# Altium schematic sheet 37-ETHERNET LEDs.SchDoc
size 513 x 386 mm
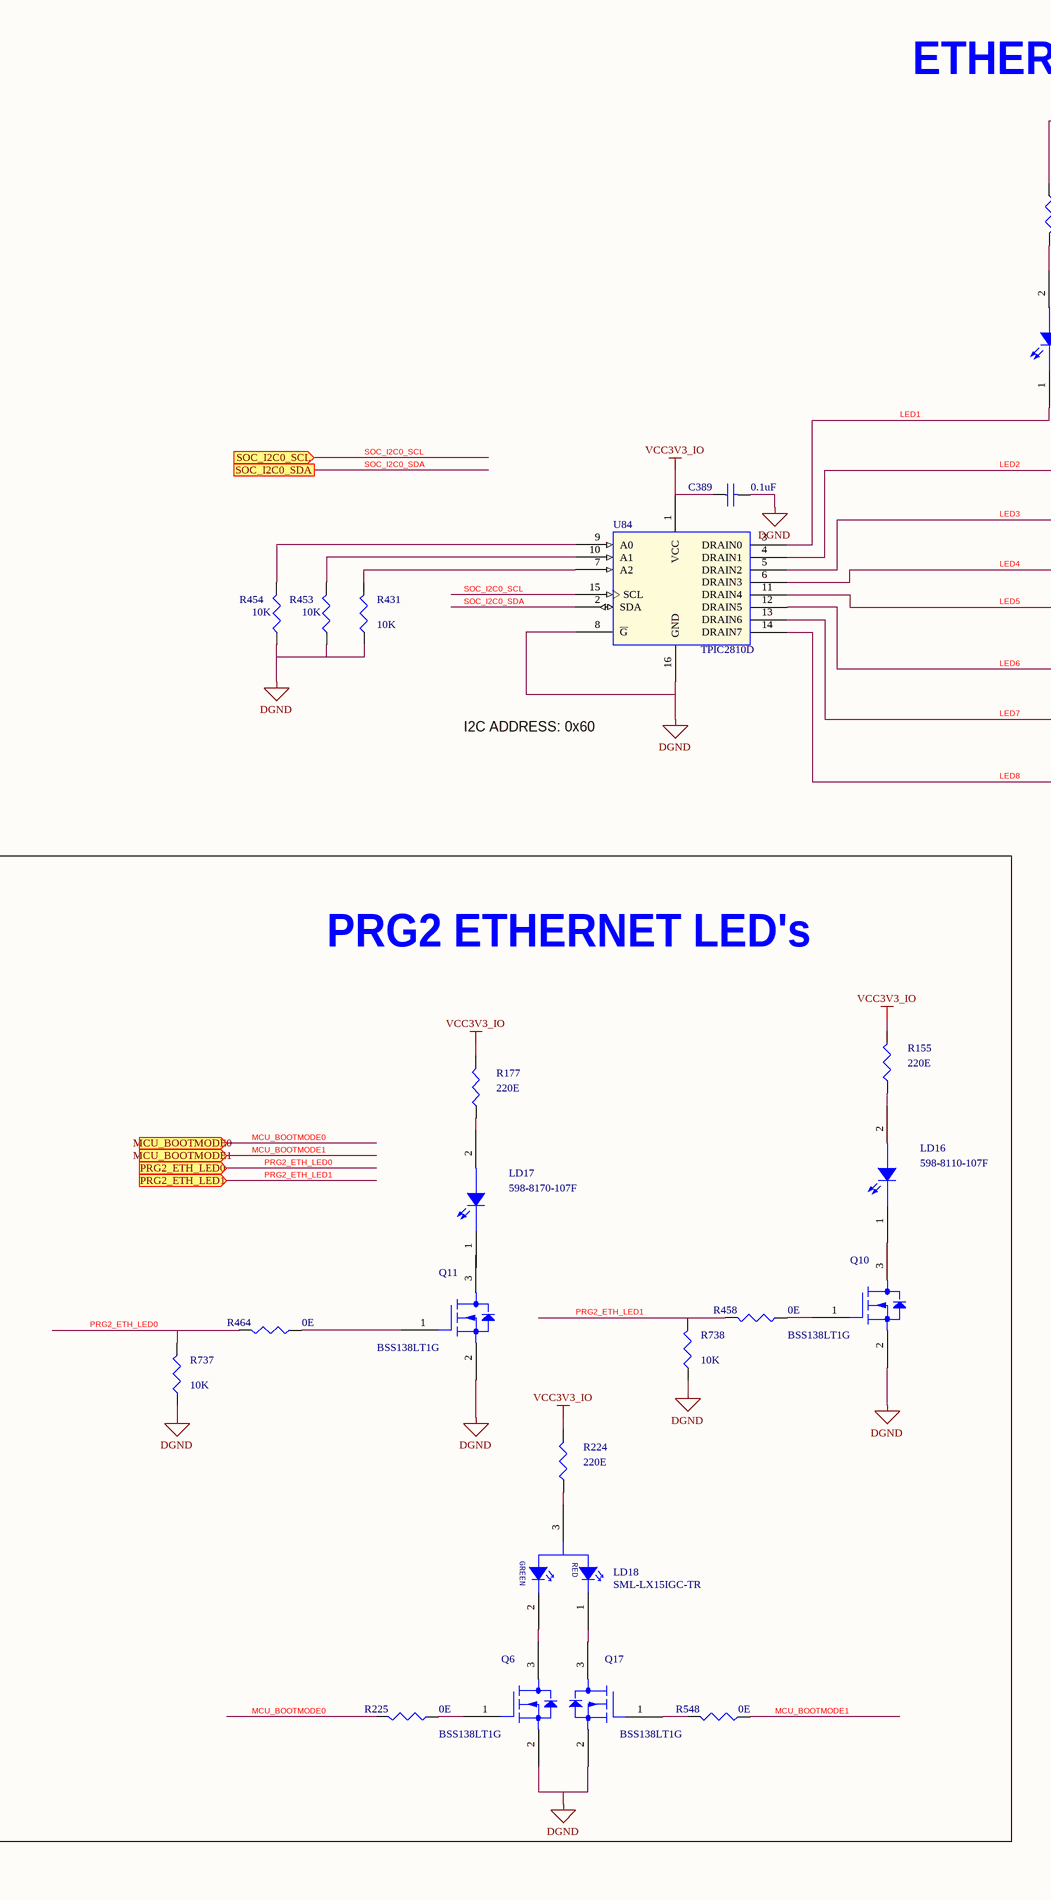
[diagram p0: 37-ETHERNET LEDs.SchDoc, left]
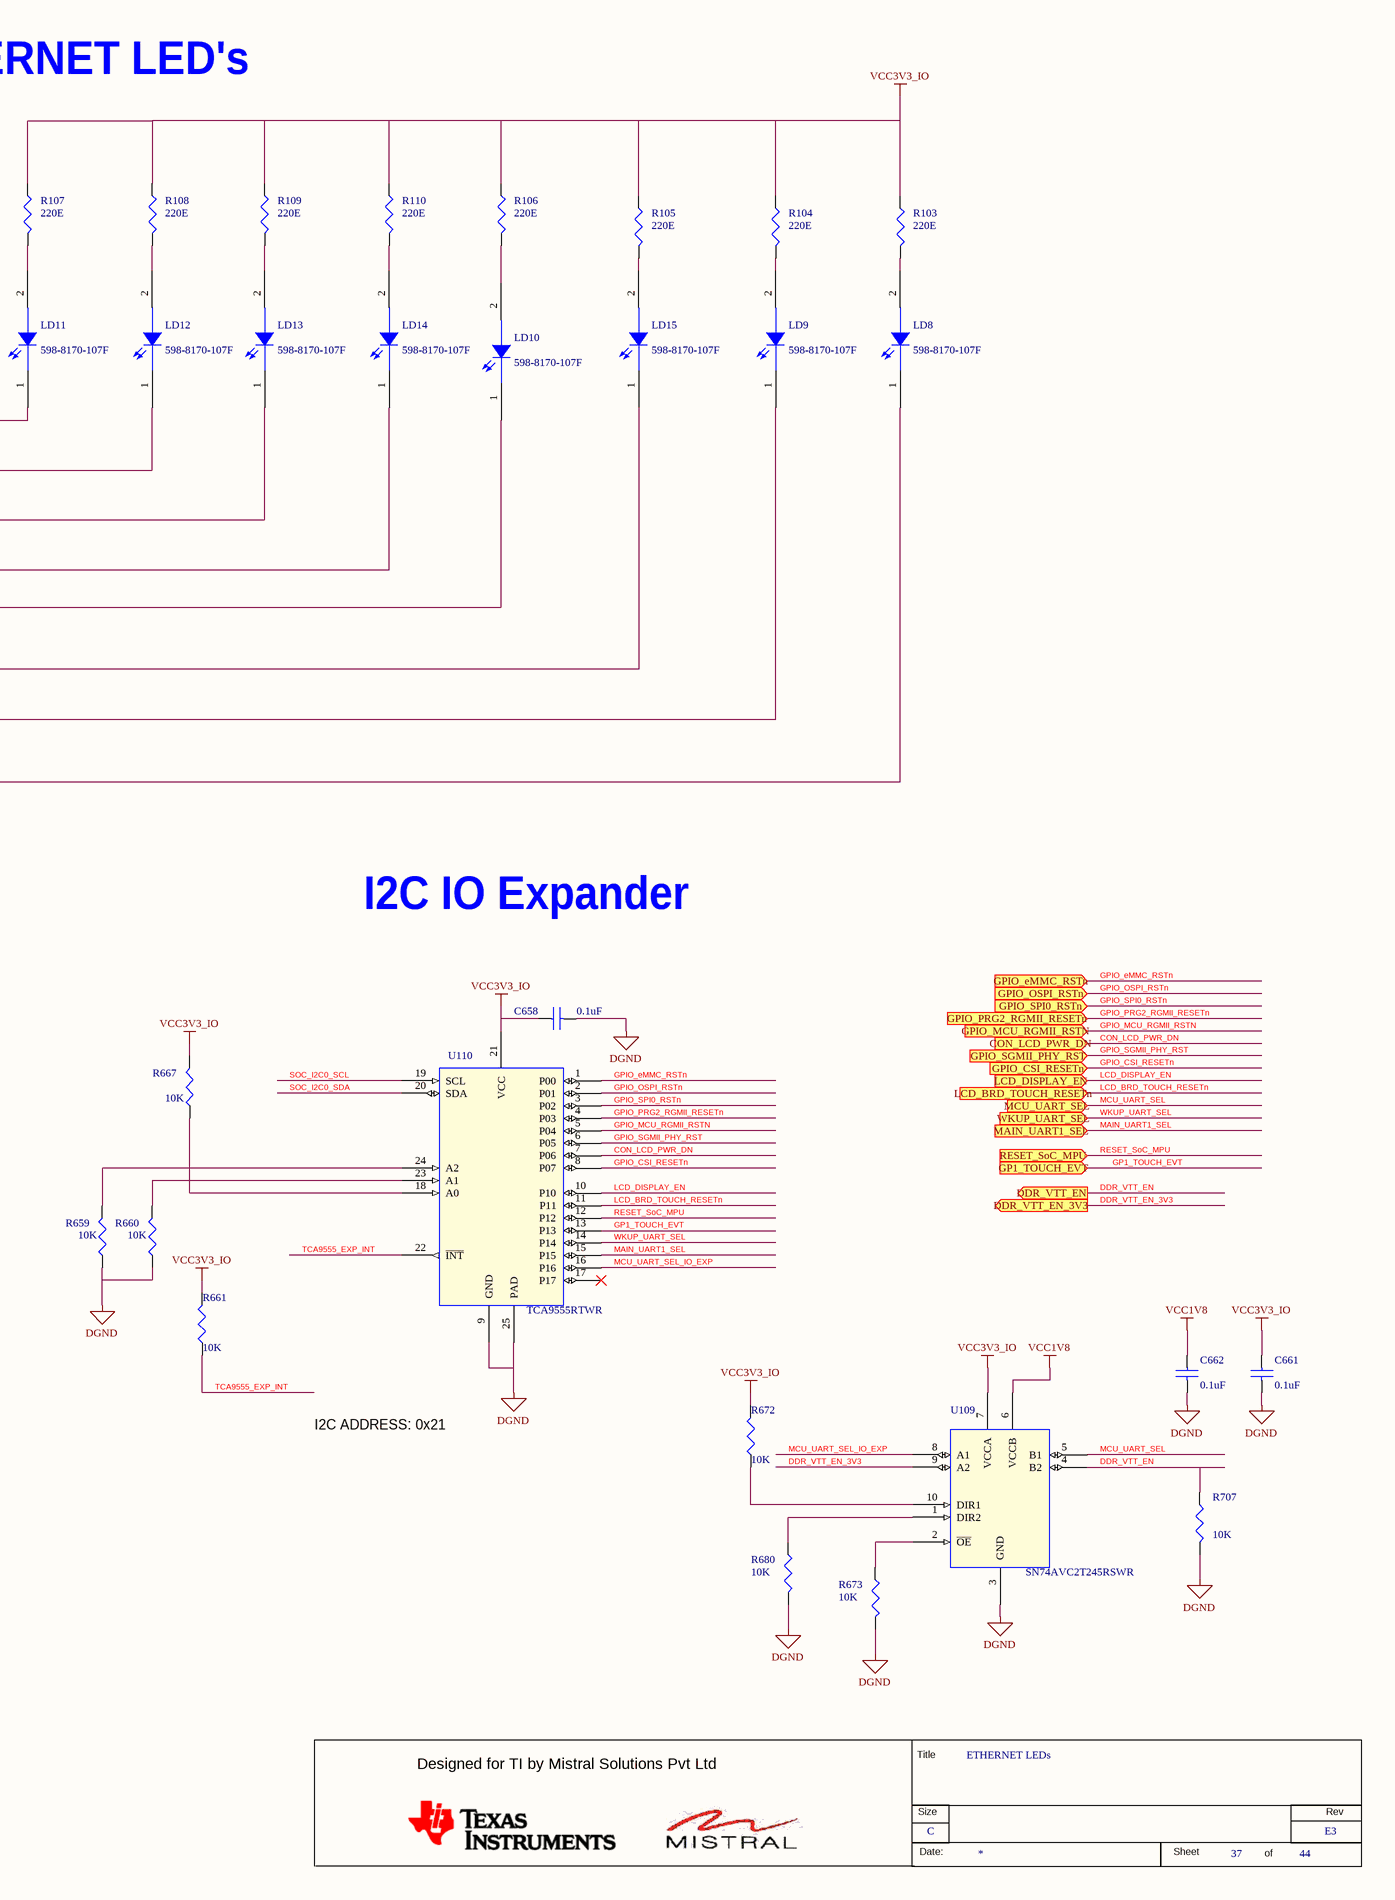
[diagram p1: 37-ETHERNET LEDs.SchDoc, right]

## Parts
*  RevCode: E3  Title: ETHERNET LEDs  Page Size: C  Page Number: 37  Page Count: 44  (hidden comment: MISTRAL_TITLEBLK_CSIZE)  (graphical)
C389  0.1uF  [CAP0201_0-5]
C658  0.1uF  [CAP0201_0-5]
C661  0.1uF  [CAP0201_0-5]
C662  0.1uF  [CAP0201_0-5]
LD8  598-8170-107F  [LED_0805_0-7]
LD9  598-8170-107F  [LED_0805_0-7]
LD10  598-8170-107F  [LED_0805_0-7]
LD11  598-8170-107F  [LED_0805_0-7]
LD12  598-8170-107F  [LED_0805_0-7]
LD13  598-8170-107F  [LED_0805_0-7]
LD14  598-8170-107F  [LED_0805_0-7]
LD15  598-8170-107F  [LED_0805_0-7]
LD16  598-8110-107F  [LED_0805]
LD17  598-8170-107F  [LED_0805_0-7]
LD18  SML-LX15IGC-TR  [LED3_SML-LX15IGC_120X120_SMD_1]
Q6  BSS138LT1G  [SOT23-123]
Q10  BSS138LT1G  [SOT23-123]
Q11  BSS138LT1G  [SOT23-123]
Q17  BSS138LT1G  [SOT23-123]
R103  220E  [RES0402_0-5]
R104  220E  [RES0402_0-5]
R105  220E  [RES0402_0-5]
R106  220E  [RES0402_0-5]
R107  220E  [RES0402_0-5]
R108  220E  [RES0402_0-5]
R109  220E  [RES0402_0-5]
R110  220E  [RES0402_0-5]
R155  220E  [RES0402_0-5]
R177  220E  [RES0402_0-5]
R224  220E  [RES0402_0-5]
R225  0E  [RES0402_0-5]
R431  10K  [RES0402_0-5]
R453  10K  [RES0402_0-5]
R454  10K  [RES0402_0-5]
R458  0E  [RES0402_0-5]
R464  0E  [RES0402_0-5]
R548  0E  [RES0402_0-5]
R659  10K  [RES0402_0-5]
R660  10K  [RES0402_0-5]
R661  10K  [RES0402_0-5]
R667  10K  [RES0402_0-5]
R672  10K  [RES0402_0-5]
R673  10K  [RES0402_0-5]
R680  10K  [RES0402_0-5]
R707  10K  [RES0402_0-5]
R737  10K  [RES0402_0-5]
R738  10K  [RES0402_0-5]
U84  TPIC2810D  [SOIC16_1-8]
U109  SN74AVC2T245RSWR  [QFN10_15-74_75X60]
U110  TCA9555RTWR  [QFN24_19-68_165X165]

## Blocks framed on the sheet
PRG2 ETHERNET LED's: LD16-LD18 Q6 Q10 Q11 Q17 R155 R177 R224 R225 R458 R464 R548 R737 R738

## Ports
CON_LCD_PWR_DN (in), DDR_VTT_EN (out), DDR_VTT_EN_3V3 (out), GP1_TOUCH_EVT (in), GPIO_CSI_RESETn (in), GPIO_eMMC_RSTn (in), GPIO_MCU_RGMII_RSTN (in), GPIO_OSPI_RSTn (in), GPIO_PRG2_RGMII_RESETn (in), GPIO_SGMII_PHY_RST (in), GPIO_SPI0_RSTn (in), LCD_BRD_TOUCH_RESETn (in), LCD_DISPLAY_EN (in), MAIN_UART1_SEL (in), MCU_BOOTMODE0 (in), MCU_BOOTMODE1 (in), MCU_UART_SEL (in), PRG2_ETH_LED0 (in), PRG2_ETH_LED1 (in), RESET_SoC_MPU (in), SOC_I2C0_SCL (in), SOC_I2C0_SDA, WKUP_UART_SEL (in)

## Nets
DGND: C389.2 C658.2 C661.2 C662.2 Q6.2(S) Q10.2(S) Q11.2(S) Q17.2(S) R431.1 R453.1 R454.1 R659.1 R660.1 R673.2 R680.2 R707.2 R737.1 R738.1 U84.8(~{G}) U84.16(GND) U109.3(GND) U110.9(GND) U110.25(PAD)
VCC1V8: C662.1 U109.6(VCCB)
VCC3V3_IO: C389.1 C658.1 C661.1 R103.1 R104.1 R105.1 R106.1 R107.1 R108.1 R109.1 R110.1 R155.2 R177.2 R224.2 R661.2 R667.2 R672.2 U84.1(VCC) U109.7(VCCA) U110.21(VCC)
CON_LCD_PWR_DN: U110.7(P06) ; port CON_LCD_PWR_DN
DDR_VTT_EN: R707.1 U109.4(B2) ; port DDR_VTT_EN
DDR_VTT_EN_3V3: U109.9(A2) ; port DDR_VTT_EN_3V3
GP1_TOUCH_EVT: U110.13(P13) ; port GP1_TOUCH_EVT
GPIO_CSI_RESETn: U110.8(P07) ; port GPIO_CSI_RESETn
GPIO_eMMC_RSTn: U110.1(P00) ; port GPIO_eMMC_RSTn
GPIO_MCU_RGMII_RSTN: U110.5(P04) ; port GPIO_MCU_RGMII_RSTN
GPIO_OSPI_RSTn: U110.2(P01) ; port GPIO_OSPI_RSTn
GPIO_PRG2_RGMII_RESETn: U110.4(P03) ; port GPIO_PRG2_RGMII_RESETn
GPIO_SGMII_PHY_RST: U110.6(P05) ; port GPIO_SGMII_PHY_RST
GPIO_SPI0_RSTn: U110.3(P02) ; port GPIO_SPI0_RSTn
LCD_BRD_TOUCH_RESETn: U110.11(P11) ; port LCD_BRD_TOUCH_RESETn
LCD_DISPLAY_EN: U110.10(P10) ; port LCD_DISPLAY_EN
LED1: LD11.1 U84.3(DRAIN0)
LED2: LD12.1 U84.4(DRAIN1)
LED3: LD13.1 U84.5(DRAIN2)
LED4: LD14.1 U84.6(DRAIN3)
LED5: LD10.1 U84.11(DRAIN4)
LED6: LD15.1 U84.12(DRAIN5)
LED7: LD9.1 U84.13(DRAIN6)
LED8: LD8.1 U84.14(DRAIN7)
MAIN_UART1_SEL: U110.15(P15) ; port MAIN_UART1_SEL
MCU_BOOTMODE0: R225.2 ; port MCU_BOOTMODE0
MCU_BOOTMODE1: R548.2 ; port MCU_BOOTMODE1
MCU_UART_SEL: U109.5(B1) ; port MCU_UART_SEL
MCU_UART_SEL_IO_EXP: U109.8(A1) U110.16(P16)
PRG2_ETH_LED0: R464.2 R737.2 ; port PRG2_ETH_LED0
PRG2_ETH_LED1: R458.2 R738.2 ; port PRG2_ETH_LED1
RESET_SoC_MPU: U110.12(P12) ; port RESET_SoC_MPU
SOC_I2C0_SCL: U84.15(SCL) U110.19(SCL) ; port SOC_I2C0_SCL
SOC_I2C0_SDA: U84.2(SDA) U110.20(SDA) ; port SOC_I2C0_SDA
TCA9555_EXP_INT: R661.1 U110.22(~{INT})
WKUP_UART_SEL: U110.14(P14) ; port WKUP_UART_SEL
NetLD8_2: LD8.2 R103.2
NetLD9_2: LD9.2 R104.2
NetLD10_2: LD10.2 R106.2
NetLD11_2: LD11.2 R107.2
NetLD12_2: LD12.2 R108.2
NetLD13_2: LD13.2 R109.2
NetLD14_2: LD14.2 R110.2
NetLD15_2: LD15.2 R105.2
NetLD16_1: LD16.1 Q10.3(D)
NetLD16_2: LD16.2 R155.1
NetLD17_1: LD17.1 Q11.3(D)
NetLD17_2: LD17.2 R177.1
NetLD18_1: LD18.1(CATHODE1) Q17.3(D)
NetLD18_2: LD18.2(CATHODE2) Q6.3(D)
NetLD18_3: LD18.3(ANODE) R224.1
NetQ6_1: Q6.1(G) R225.1
NetQ10_1: Q10.1(G) R458.1
NetQ11_1: Q11.1(G) R464.1
NetQ17_1: Q17.1(G) R548.1
NetR431_2: R431.2 U84.7(A2)
NetR453_2: R453.2 U84.10(A1)
NetR454_2: R454.2 U84.9(A0)
NetR659_2: R659.2 U110.24(A2)
NetR660_2: R660.2 U110.23(A1)
NetR667_1: R667.1 U110.18(A0)
NetR672_1: R672.1 U109.10(DIR1)
NetR673_1: R673.1 U109.2(~{OE})
NetR680_1: R680.1 U109.1(DIR2)

Not connected (* = marked no-connect by the designer): U110 17(P17)*

## Notes on the sheet
- ETHERNET LED's
- I2C ADDRESS: 0x60
- I2C IO Expander
- I2C ADDRESS: 0x21
- (in symbol LED3_SML-LX15IGC) GREEN; RED
- (in symbol MISTRAL_TITLEBLK_CSIZE) Title; Designed for TI by Mistral Solutions Pvt Ltd; Size; Rev; Date:; Sheet; of

## Library data of the parts
* = MISTRAL_TITLEBLK_CSIZE: Issue: 1.0; Page Create Date: March  8, 1995; Page Modify Date: *
C389 C658 C661 = CAP_Dup5: CAP CERAMIC 0.1uF 16V 10% X5R 0201; Mistral Part No: 120009030072-R; Mfr_name: MURATA; Mfr_part_number: GRM033R61C104KE84J; Part_type: CAPACITORS\CERAMIC; Project: TI_MAXIE_CPB; Wattage: NA; Customs_HS_Code: 85322990; Custom_Duty: 15%; Tolerance: 10%; Voltage: 16V; Package: 0201; Distributor_name: DIGIKEY; Distributor_part_number: 490-16742-1-ND; Height: 0.33MM; Weight: 0.33mg; Temperature: -55°C+85°C; Datasheet: Y:\MIS_DATABASE\DATASHEETS\CAPACITORS\GRM033R61C104KE84.PDF; Crtd /date: MANIRAJA/120218; Chkd/date: MANIRAJA/120218; MECHANICAL 3D STEP FILE: CAP0201_0-5; PCB Footprint: CAP0201_0-5; Library Ref: CAP
C662 = CAP_Dup5: CAP CERAMIC 0.1uF 16V 10% X5R 0201; Part_type: CAPACITORS\CERAMIC; Mfr_part_number: GRM033R61C104KE84J; Mfr_name: MURATA; Mistral Part No: 120009030072-R; Custom_Duty: 15%; Customs_HS_Code: 85322990; Wattage: NA; Project: TI_MAXIE_CPB; MECHANICAL 3D STEP FILE: CAP0201_0-5; Chkd/date: MANIRAJA/120218; Crtd /date: MANIRAJA/120218; Datasheet: Y:\MIS_DATABASE\DATASHEETS\CAPACITORS\GRM033R61C104KE84.PDF; Temperature: -55°C+85°C; Weight: 0.33mg; Height: 0.33MM; Distributor_part_number: 490-16742-1-ND; Distributor_name: DIGIKEY; Package: 0201; Voltage: 16V; Tolerance: 10%; PCB Footprint: CAP0201_0-5; Library Ref: CAP
LD8 LD9 LD12-LD15 = LED_598-8170-107F: LED ALINGAP GREEN CLEAR 0805; Mistral Part No: 130014050065-R; Mfr_name: DIALIGHT; Part_type: OPTO\LED; Project: AEGIS GP BETA2; Tolerance: NA; Customs_HS_Code: 85437099; Custom_Duty: 24%; Mfr_part_number: 598-8170-107F; Voltage: NA; Wattage: NA; Package: 0805; Distributor_name: DIGIKEY; Distributor_part_number: 350-2044-1-ND; Height: 0.70MM; Weight: NA; Temperature: -30°C+85°C; Datasheet: Y:\MIS_DATABASE\DATASHEETS\DISCRETES\LEDS\598-SER.PDF; Crtd /date: SARANYA/070514; Chkd/date: MANIRAJA/230817; MECHANICAL 3D STEP FILE: LED_0805_0-7; PCB Footprint: LED_0805_0-7; Library Ref: LED_598-8170-107F
LD10 LD11 LD17 = LED_598-8170-107F: LED ALINGAP GREEN CLEAR 0805; Part_type: OPTO\LED; Mfr_name: DIALIGHT; Mistral Part No: 130014050065-R; Custom_Duty: 24%; Customs_HS_Code: 85437099; Wattage: NA; Project: AEGIS GP BETA2; MECHANICAL 3D STEP FILE: LED_0805_0-7; Chkd/date: MANIRAJA/230817; Crtd /date: SARANYA/070514; Datasheet: Y:\MIS_DATABASE\DATASHEETS\DISCRETES\LEDS\598-SER.PDF; Temperature: -30°C+85°C; Weight: NA; Height: 0.70MM; Distributor_part_number: 350-2044-1-ND; Distributor_name: DIGIKEY; Package: 0805; Voltage: NA; Tolerance: NA; Mfr_part_number: 598-8170-107F; PCB Footprint: LED_0805_0-7; Library Ref: LED_598-8170-107F
LD16 = LED_598-8170-107F: LED ALINGAP RED CLEAR 0805 SMD; Part_type: OPTO\LED; Mfr_name: DIALIGHT; Mistral Part No: 130014050069-R; Custom_Duty: 24%; Customs_HS_Code: 85437099; Wattage: NA; Project: AEGIS GP BETA2; PCB Footprint: LED_0805; Chkd/date: BALACHANDAR/160514; Crtd /date: SARANYA/070514; Datasheet: Y:\MIS_DATABASE\DATASHEETS\DISCRETES\LEDS\598-SER.PDF; Temperature: NA; Weight: NA; Height: 0.70MM; Distributor_part_number: 350-2038-1-ND; Distributor_name: DIGIKEY; Package: 0805; Voltage: NA; Tolerance: NA; Mfr_part_number: 598-8110-107F; Library Ref: LED_598-8170-107F
LD18 = LED3_SML-LX15IGC: DIODE LED GREEN/RED SMD; Part_type: OPTO\LED; Mfr_name: LUMEX; Mistral Part No: 130017090021-R; Custom_Duty: 24%; Customs_HS_Code: 85439000; Wattage: NA; Project: TI_MAXIE_CPB; PCB Footprint: LED3_SML-LX15IGC_120X120_SMD_1; MECHANICAL 3D STEP FILE: LED3_SML-LX15IGC_120X120_SMD_1; Chkd/date: MANIRAJA/180917; Crtd /date: MANIRAJA/180917; Datasheet: Y:\MIS_DATABASE\DATASHEETS\DISCRETES\LEDS\SML-LX15IGC.PDF; Temperature: -40°C+85°C; Weight: NA; Height: 1.00MM; Distributor_part_number: 67-2193-1-ND; Distributor_name: DIGIKEY; Package: SMD; Voltage: NA; Tolerance: NA; Mfr_part_number: SML-LX15IGC-TR; Library Ref: LED3_SML-LX15IGC
Q6 Q10 Q11 = MOSFET_BSS138LT1G: IC MOSFET N-CHANNEL 50V, SOT23-3; Part_type: ICS\POWER\MOSFET; Mfr_name: ON SEMICONDUCTOR; Mistral Part No: 142016040001-R; Custom_Duty: 15%; Customs_HS_Code: 85423100; Wattage: NA; Project: LRDE_ABCM; PCB Footprint: SOT23-123; Chkd/date: VASANTHA/150416; Crtd /date: JEBRAN/060416; Datasheet: Y:\MIS_DATABASE\DATASHEETS\DISCRETES\TRANSISTORS_FETS\BSS138LT1G.PDF; Temperature: -55°C+150°C; Weight: NA; Height: 1.11MM; Distributor_part_number: 863-BSS138LT1G; Distributor_name: MOUSER; Package: SOT23-3; Voltage: 50V; Tolerance: NA; Mfr_part_number: BSS138LT1G; Library Ref: MOSFET_BSS138LT1G
Q17 = MOSFET_BSS138LT1G: IC MOSFET N-CHANNEL 50V, SOT23-3; Mistral Part No: 142016040001-R; Mfr_name: ON SEMICONDUCTOR; Part_type: ICS\POWER\MOSFET; Project: LRDE_ABCM; Tolerance: NA; Customs_HS_Code: 85423100; Custom_Duty: 15%; PCB Footprint: SOT23-123; Mfr_part_number: BSS138LT1G; Voltage: 50V; Wattage: NA; Package: SOT23-3; Distributor_name: MOUSER; Distributor_part_number: 863-BSS138LT1G; Height: 1.11MM; Weight: NA; Temperature: -55°C+150°C; Datasheet: Y:\MIS_DATABASE\DATASHEETS\DISCRETES\TRANSISTORS_FETS\BSS138LT1G.PDF; Crtd /date: JEBRAN/060416; Chkd/date: VASANTHA/150416; Library Ref: MOSFET_BSS138LT1G
R103-R105 R109 R110 = RESISTOR_Dup5: RES 220E 1/16W 5% 0402; Mistral Part No: 110009030506-R; Mfr_name: PANASONIC-ECG; Mfr_part_number: ERJ-2GEJ221X; Part_type: RESISTORS\FIXED; Project: RED EYE; Customs_HS_Code: 85332119; Custom_Duty: 15%; Voltage: NA; Tolerance: 5%; Wattage: 1/16W; Package: 0402; Distributor_name: DIGIKEY; Distributor_part_number: P220JCT-ND; Height: 0.40MM; Datasheet: Y:\MIS_DATABASE\DATASHEETS\RESISTORS\ERJ12.PDF; Crtd /date: GEETHA/260406; Chkd/date: VASANTHA/291216; Library Ref: RESISTOR; PCB Footprint: RES0402_0-5; Weight: 0.8g/1000pcs; Temperature: -55°C+155°C; MECHANICAL 3D STEP FILE: RES0402_0-5; Library Path: Y:\MIS_DATABASE\Library\ALTIUM_TOOL\SCHEMATICS_PARTS\MS_DISCRETE_Library.schlib; Footprint Path: Y:\MIS_DATABASE\Library\ALTIUM_TOOL\PCB_FOOTPRINTS\Altium_Footprint_Lib.PcbLib
R106-R108 R155 R177 R224 = RESISTOR_Dup5: RES 220E 1/16W 5% 0402; Part_type: RESISTORS\FIXED; Mfr_part_number: ERJ-2GEJ221X; Mfr_name: PANASONIC-ECG; Mistral Part No: 110009030506-R; Custom_Duty: 15%; Customs_HS_Code: 85332119; Project: RED EYE; Voltage: NA; Chkd/date: VASANTHA/291216; Crtd /date: GEETHA/260406; Datasheet: Y:\MIS_DATABASE\DATASHEETS\RESISTORS\ERJ12.PDF; Height: 0.40MM; Distributor_part_number: P220JCT-ND; Distributor_name: DIGIKEY; Package: 0402; Wattage: 1/16W; Tolerance: 5%; Library Ref: RESISTOR; PCB Footprint: RES0402_0-5; Weight: 0.8g/1000pcs; Temperature: -55°C+155°C; MECHANICAL 3D STEP FILE: RES0402_0-5; Library Path: Y:\MIS_DATABASE\Library\ALTIUM_TOOL\SCHEMATICS_PARTS\MS_DISCRETE_Library.schlib; Footprint Path: Y:\MIS_DATABASE\Library\ALTIUM_TOOL\PCB_FOOTPRINTS\Altium_Footprint_Lib.PcbLib
R225 R458 R548 = RESISTOR_Dup4: RES 0E 1/16W 0402; Part_type: RESISTORS\FIXED; Mfr_part_number: CRCW04020000Z0ED; Mfr_name: VISHAY; Mistral Part No: 110010080019-P; Custom_Duty: 15%; Customs_HS_Code: 85332119; Voltage: NA; Project: PB_BUGBASE; PCB Footprint: RES0402_0-5; MECHANICAL 3D STEP FILE: RES0402_0-5; RoHS: Pb-Free; Chkd/date: VASANTHA/201216; Crtd /date: MUDDU/190810; Datasheet: Y:\MIS_DATABASE\DATASHEETS\RESISTORS\CRCW0603.PDF; Temperature: -55°C+155°C; Weight: 0.65g/1000pcs; Height: 0.40MM; Distributor_part_number: 541-0.0JCT-ND; Distributor_name: DIGIKEY; Package: 0402; Wattage: 1/16W; Tolerance: NA; Library Ref: RESISTOR; Footprint Ref: RES0402_0-5; Library Path: Y:\MIS_DATABASE\Library\ALTIUM_TOOL\SCHEMATICS_PARTS\MS_DISCRETE_Library.schlib; Footprint Path: Y:\MIS_DATABASE\Library\ALTIUM_TOOL\PCB_FOOTPRINTS\Altium_Footprint_Lib.PcbLib
R431 R454 R659 R661 R667 = RESISTOR_Dup5: RES 10K 1/16W 5% 0402; Mistral Part No: 110009030208-R; Mfr_name: YAGEO AMERICA; Mfr_part_number: RC0402JR-0710KL; Part_type: RESISTORS\FIXED; Project: HSE; Voltage: NA; Customs_HS_Code: 85332119; Custom_Duty: 15%; Tolerance: 5%; Wattage: 1/16W; Package: 0402; Distributor_name: DIGIKEY; Distributor_part_number: 311-10KJRCT-ND; Height: 0.40MM; Weight: 0.65mg; Temperature: -55°C+155°C; Datasheet: Y:\MIS_DATABASE\DATASHEETS\RESISTORS\YAGEO-RC0402.PDF; Crtd /date: MAZHAR/230805; Chkd/date: VASANTHA/061216; RoHS: Pb-Free; MECHANICAL 3D STEP FILE: RES0402_0-5; PCB Footprint: RES0402_0-5; Library Ref: RESISTOR; Footprint Ref: RES0402_0-5; Library Path: Y:\MIS_DATABASE\Library\ALTIUM_TOOL\SCHEMATICS_PARTS\MS_DISCRETE_Library.schlib; Footprint Path: Y:\MIS_DATABASE\Library\ALTIUM_TOOL\PCB_FOOTPRINTS\Altium_Footprint_Lib.PcbLib
R453 R660 R672 R673 R680 R707 R737 R738 = RESISTOR_Dup5: RES 10K 1/16W 5% 0402; Part_type: RESISTORS\FIXED; Mfr_part_number: RC0402JR-0710KL; Mfr_name: YAGEO AMERICA; Mistral Part No: 110009030208-R; Custom_Duty: 15%; Customs_HS_Code: 85332119; Voltage: NA; Project: HSE; MECHANICAL 3D STEP FILE: RES0402_0-5; RoHS: Pb-Free; Chkd/date: VASANTHA/061216; Crtd /date: MAZHAR/230805; Datasheet: Y:\MIS_DATABASE\DATASHEETS\RESISTORS\YAGEO-RC0402.PDF; Temperature: -55°C+155°C; Weight: 0.65mg; Height: 0.40MM; Distributor_part_number: 311-10KJRCT-ND; Distributor_name: DIGIKEY; Package: 0402; Wattage: 1/16W; Tolerance: 5%; PCB Footprint: RES0402_0-5; Library Ref: RESISTOR; Footprint Ref: RES0402_0-5; Library Path: Y:\MIS_DATABASE\Library\ALTIUM_TOOL\SCHEMATICS_PARTS\MS_DISCRETE_Library.schlib; Footprint Path: Y:\MIS_DATABASE\Library\ALTIUM_TOOL\PCB_FOOTPRINTS\Altium_Footprint_Lib.PcbLib
R464 = RESISTOR_Dup4: RES 0E 1/16W 0402; Mistral Part No: 110010080019-P; Mfr_name: VISHAY; Mfr_part_number: CRCW04020000Z0ED; Part_type: RESISTORS\FIXED; Project: PB_BUGBASE; Tolerance: NA; Customs_HS_Code: 85332119; Custom_Duty: 15%; PCB Footprint: RES0402_0-5; Voltage: NA; Wattage: 1/16W; Package: 0402; Distributor_name: DIGIKEY; Distributor_part_number: 541-0.0JCT-ND; Height: 0.40MM; Weight: 0.65g/1000pcs; Temperature: -55°C+155°C; Datasheet: Y:\MIS_DATABASE\DATASHEETS\RESISTORS\CRCW0603.PDF; Crtd /date: MUDDU/190810; Chkd/date: VASANTHA/201216; RoHS: Pb-Free; MECHANICAL 3D STEP FILE: RES0402_0-5; Library Ref: RESISTOR; Footprint Ref: RES0402_0-5; Library Path: Y:\MIS_DATABASE\Library\ALTIUM_TOOL\SCHEMATICS_PARTS\MS_DISCRETE_Library.schlib; Footprint Path: Y:\MIS_DATABASE\Library\ALTIUM_TOOL\PCB_FOOTPRINTS\Altium_Footprint_Lib.PcbLib
U84 = TPIC2810D_SOIC16: IC 8-BIT LED DRIVER WITH I2C INTERFACE SOIC16; Mistral Part No: 141017080026-R; Mfr_name: TEXAS INSTRUMENTS; Part_type: ICS\INTERFACE; Project: TI_MAXIE_CPB; Tolerance: NA; Customs_HS_Code: 85423100; Custom_Duty: 15%; Mfr_part_number: TPIC2810D; Voltage: NA; Wattage: NA; Package: SOIC16; Distributor_name: DIGIKEY; Distributor_part_number: 296-13746-5-ND; Height: 1.75MM; Weight: NA; Temperature: -40°C+125°C; Datasheet: Y:\MIS_DATABASE\DATASHEETS\ICS\INTERFACE\TPIC2810D.PDF; Crtd /date: MANIRAJA/220817; Chkd/date: MANIRAJA/230817; MECHANICAL 3D STEP FILE: SOIC16_1-8; PCB Footprint: SOIC16_1-8; Library Ref: TPIC2810D_SOIC16
U109 = SN74AVC2T245RSWR_QFN10: IC DUAL-BIT DUAL SUPPLY BUS TRANSCEIVER QFN10; Mistral Part No: 143009030061-R; Mfr_name: TEXAS INSTRUMENTS; Part_type: ICS\TELECOM\TRANSCEIVER; Project: AXON; Customs_HS_Code: 85423100; Custom_Duty: 15%; Mfr_part_number: SN74AVC2T245RSWR; Package: QFN10; Distributor_name: DIGIKEY; Distributor_part_number: 296-23684-1-ND; Height: 0.55MM; Temperature: -40°C+85°C; Datasheet: Y:\MIS_DATABASE\DATASHEETS\ICS\DIGITAL\BUSTRANSCEIVER\SN74AVC2T245RSWR.PDF; Crtd /date: USMAN/130309; Chkd/date: SUHAS/031110; RoHS: Sb/ Br FREE; PCB Footprint: QFN10_15-74_75X60; Library Ref: SN74AVC2T245RSWR_QFN10
U110 = TCA9555RTWR_WQFN24: IC I/O EXPANDER I2C BUS 16-BIT WQFN24; Part_type: ICS\DIGITAL\BUSTRANSCEIVER; Mfr_name: TEXAS INSTRUMENTS; Mistral Part No: 141013080010-R; Wattage: NA; Project: RTM; Chkd/date: USMAN/120913; Crtd /date: VIJAYALAKSHMI/200813; Datasheet: Y:\MIS_DATABASE\DATASHEETS\ICS\DIGITAL\BUSTRANSCEIVER\TCA9555X.PDF; Temperature: -40°C+85°C; Weight: NA; Height: 0.80MM; Distributor_part_number: 296-24857-1-ND; Distributor_name: DIGIKEY; Package: WQFN24; Voltage: NA; Tolerance: NA; Mfr_part_number: TCA9555RTWR; PCB Footprint: QFN24_19-68_165X165; Library Ref: TCA9555RTWR_WQFN24